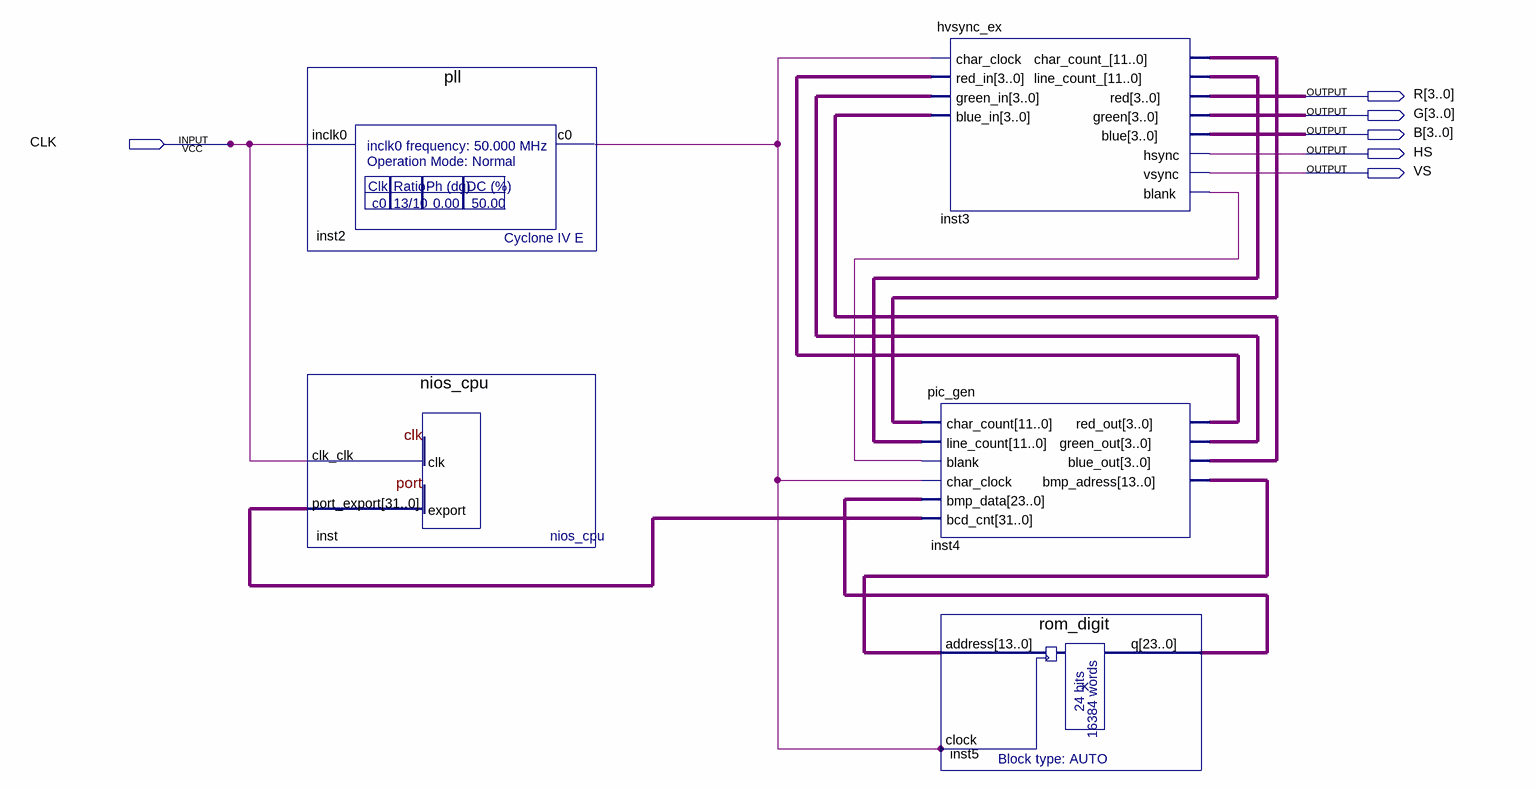
[diagram p0: schematic sheet]
// Quartus schematic nios_II.bdf as structural Verilog: 5 symbols, 6 pins
module nios_II (
  input  CLK,
  output [3:0] R,
  output [3:0] G,
  output [3:0] B,
  output HS,
  output VS
);

  wire inst2_c0, inst3_blank;
  wire [3:0] inst4_blue_out, inst4_green_out, inst4_red_out;
  wire [11:0] inst3_char_count_, inst3_line_count_;
  wire [13:0] inst4_bmp_adress;
  wire [23:0] inst5_q;
  wire [31:0] inst_port_export;

  pll inst2 (.inclk0(CLK), .c0(inst2_c0));
  nios_cpu inst (.clk_clk(CLK), .port_export(inst_port_export));
  hvsync_ex inst3 (
    .char_clock(inst2_c0), .red_in(inst4_red_out), .green_in(inst4_green_out), .blue_in(inst4_blue_out),
    .char_count_(inst3_char_count_), .line_count_(inst3_line_count_), .red(R), .green(G), .blue(B),
    .hsync(HS), .vsync(VS), .blank(inst3_blank));
  pic_gen inst4 (
    .char_count(inst3_char_count_), .line_count(inst3_line_count_), .blank(inst3_blank),
    .char_clock(inst2_c0), .bmp_data(inst5_q), .bcd_cnt(inst_port_export), .red_out(inst4_red_out),
    .green_out(inst4_green_out), .blue_out(inst4_blue_out), .bmp_adress(inst4_bmp_adress));
  rom_digit inst5 (.address(inst4_bmp_adress), .clock(inst2_c0), .q(inst5_q));
endmodule
